# Altium project Bluetooth_antenna.PrjPcb
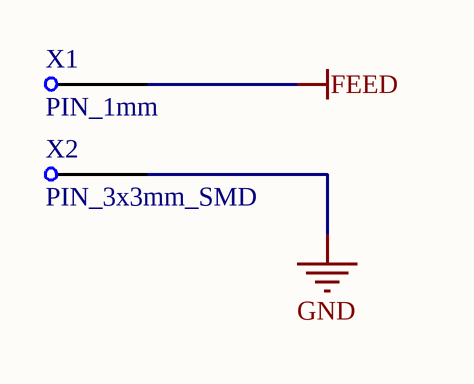
[diagram p0: Main.SchDoc]
1 sheet, 2 parts. Net scope: global (net labels, ports and power ports of the same name join across sheets).
Board file: Bluetooth_antenna.PcbDoc

## Sheet Main.SchDoc
size A4

### Parts
X1  PIN_1mm  [PIN_1mm]
X2  PIN_3x3mm_SMD  [PIN_3x3mm_SMD]

### Nets
FEED: X1.1
GND: X2.1